# Altium schematic sheet Master MicroController Serial Communication Port.SchDoc: Master MicroController Communication Port Pin Out
size A4; DocumentNumber: 27; SheetNumber: 27; SheetTotal: 54
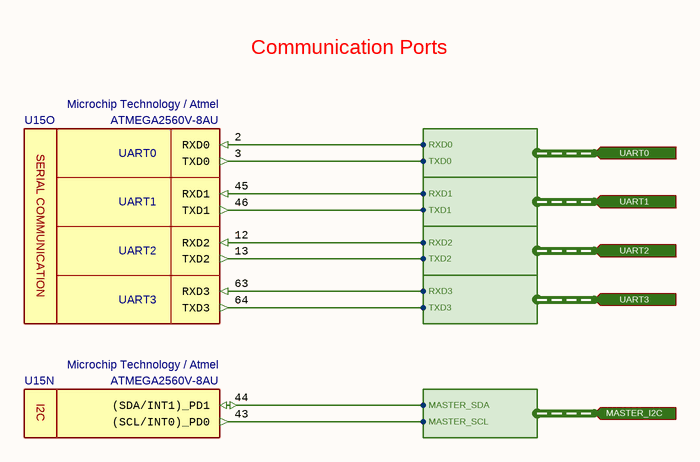
[diagram p0: Master MicroController Serial Communication Port.SchDoc]

## Parts
U15  Manufacturer_Part_Number: ATMEGA2560V-8AU  Manufacturer_Name: Microchip Technology / Atmel  [TQFP100]  (hidden comment: 8-bit MicroController)  (parts N,O of 15)

## Ports
MASTER_I2C (in, harness MASTER_I2C), UART0 (in, harness UART0), UART1 (in, harness UART1), UART2 (in, harness UART2), UART3 (in, harness UART3)

## Harnesses
UART0: RXD0, TXD0
UART1: RXD1, TXD1
UART2: RXD2, TXD2
UART3: RXD3, TXD3
MASTER_I2C: MASTER_SDA, MASTER_SCL

## Nets
NetU15_2: U15.2(RXD0) ; port UART0.RXD0
NetU15_3: U15.3(TXD0) ; port UART0.TXD0
NetU15_12: U15.12(RXD2) ; port UART2.RXD2
NetU15_13: U15.13(TXD2) ; port UART2.TXD2
NetU15_43: U15.43((SCL/INT0)_PD0) ; port MASTER_I2C.MASTER_SCL
NetU15_44: U15.44((SDA/INT1)_PD1) ; port MASTER_I2C.MASTER_SDA
NetU15_45: U15.45(RXD1) ; port UART1.RXD1
NetU15_46: U15.46(TXD1) ; port UART1.TXD1
NetU15_63: U15.63(RXD3) ; port UART3.RXD3
NetU15_64: U15.64(TXD3) ; port UART3.TXD3

## Notes on the sheet
- Communication Ports
- Engineer
- All Rights are reserved to Customer and Engineer. [2021]
- Size:
- Date:
- A4
- Project :
- Time:
- Sheet
- of
- Customer
- Product ID
- Module ID
- Version
- File:
- Revision
- (in symbol IC - ATMEGA2560V-8AU, part N) I2C
- (in symbol IC - ATMEGA2560V-8AU, part O) UART0; UART1; SERIAL COMMUNICATION; UART2; UART3

## Library data of the parts
U15 = IC - ATMEGA2560V-8AU: 8-bit Microcontrollers - MCU 256kB Flash 4kB EEPROM 86 I/O Pins; Supply Voltage - Min: 2V7; Supply Voltage - Max: 5.5V; Height: 1mm; Mouser_Part_Number: 556-ATMEGA2560V8AU; ComponentLink1Description: DataSheet; ComponentLink1URL: https://eu.mouser.com/datasheet/2/268/Atmel-2549-8-bit-AVR-Microcontroller-ATmega640-128-1315286.pdf; ROHS: Yes; Minimum Operating Temperature: -40; Maximum Operating Temperature: +85; ComponentLink2Description: Mouser; ComponentLink2URL: https://eu.mouser.com/ProductDetail/Microchip-Technology-Atmel/ATMEGA2560V-8AU?qs=sGAEpiMZZMutXGli8Ay4kKlCYcvZUWqJYdtgGFyqFT8%3D; Supplier 1: Mouser; Supplier 2: Arrow; Supplier 3: Farnell; Supplier 4: Newark; Supplier 5: Digi-Key; Supplier Part Number 1: 556-ATMEGA2560V8AU; Supplier Part Number 2: ATMEGA2560V-8AU; Supplier Part Number 3: 1288331; Supplier Part Number 4: 68T2784; Supplier Part Number 5: ATMEGA2560V-8AU-ND; Case: TQFP-100